# EAGLE design Stepper Tester (EAGLE 7.2.0)
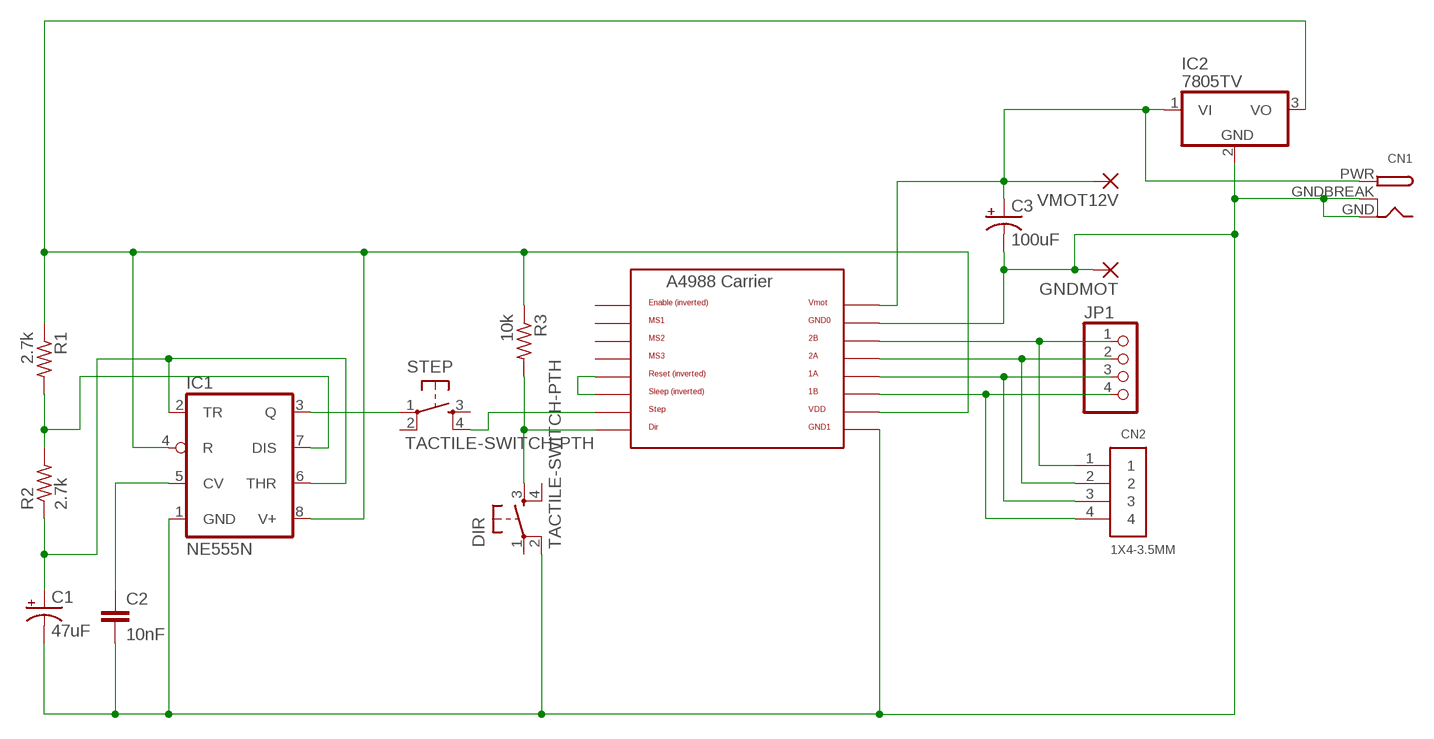
[diagram p0: schematic, sheet 1]

## Parts
C1  47uF  CPOL-USB45181B  [B45181B]
C2  10nF  C-EU050-024X044  [C050-024X044]
C3  100uF  CPOL-USE3.5-10  [E3,5-10]
CN1  DCBARRELPTH  [DCJACK_2MM_PTH]
CN2  1X4-3.5MM  [1X04-3.5MM]
DIR  TACTILE-SWITCH-PTH  [TAC-SWITCH-PTH]
GNDMOT  3,81/1,4  [3,81/1,4]
IC1  NE555N  [DIL08-ROUND]
IC2  7805TV  [TO220V]
JP1  PINHD-1X4  [1X04]
R1  2.7k  R-US_0414/15  [0414/15]
R2  2.7k  R-US_0414/15  [0414/15]
R3  10k  R-US_0414/15  [0414/15]
STEP  TACTILE-SWITCH-PTH  [TAC-SWITCH-PTH]
U$1  A4983CARRIER  [A4988BREAKOUT]
VMOT12V  3,81/1,4  [3,81/1,4]

## Nets
N$2: C2.1 IC1.5(CV)
N$3: C1.+ IC1.2(TR) IC1.6(THR) R2.1
N$4: IC1.7(DIS) R1.2 R2.2
N$5: IC1.4(R) IC1.8(V+) IC2.3(VO) R1.1 R3.1 U$1.VDD
N$6: IC1.3(Q) STEP.1
N$7: STEP.4 U$1.STEP
N$8: CN2.2 JP1.2 U$1.2A
N$9: CN2.3 JP1.3 U$1.1A
N$10: U$1.RST U$1.SLP(SLEEP)
N$11: DIR.3 R3.2 U$1.DIR
N$12: CN2.1 JP1.1 U$1.2B
N$13: CN2.4 JP1.4 U$1.1B
N$14: C3.+ CN1.PWR IC2.1(VI) U$1.VMOT VMOT12V.1(P)
N$15: C1.- C2.2 C3.- CN1.GND CN1.GNDBREAK DIR.2 GNDMOT.1(P) IC1.1(GND) IC2.2(GND) U$1.GND0 U$1.GND1
Unconnected: DIR.1 DIR.4 STEP.2 STEP.3 U$1.EN U$1.MS1 U$1.MS2 U$1.MS3

## Library data of the parts
C1 C3 = rcl:CPOL-US: POLARIZED CAPACITOR, American symbol
C2 = rcl:C-EU: CAPACITOR, European symbol
CN1 = adafruit:DCBARREL: 2.0mm DC Barrel Jack DCJACK_2MM_PTH - Through Hole Jack (4UConnector: 05537)
CN2 = adafruit:1X4: 4-pin connector
DIR STEP = GeekAmmo:TACTILE-SWITCH: Tactile Switch 4 Pins, SPST NO
GNDMOT VMOT12V = wirepad:3,81/1,4: THROUGH-HOLE PAD
IC1 = adafruit:*555: TIMER Changed DIP package to have round (not oval) pin pads http://www.ladyada.net/library/pcb/eaglelibrary.html
IC2 = linear:78*: Positive VOLTAGE REGULATOR Source: http://cache.national.com/ds/LM/LM78L05.pdf http://www.fairchildsemi.com/ds/LM/LM7805.pdf
JP1 = pinhead:PINHD-1X4: PIN HEADER
R1-R3 = rcl:R-US_: RESISTOR, American symbol
U$1 = RepRapjr:A4983CARRIER

## Board
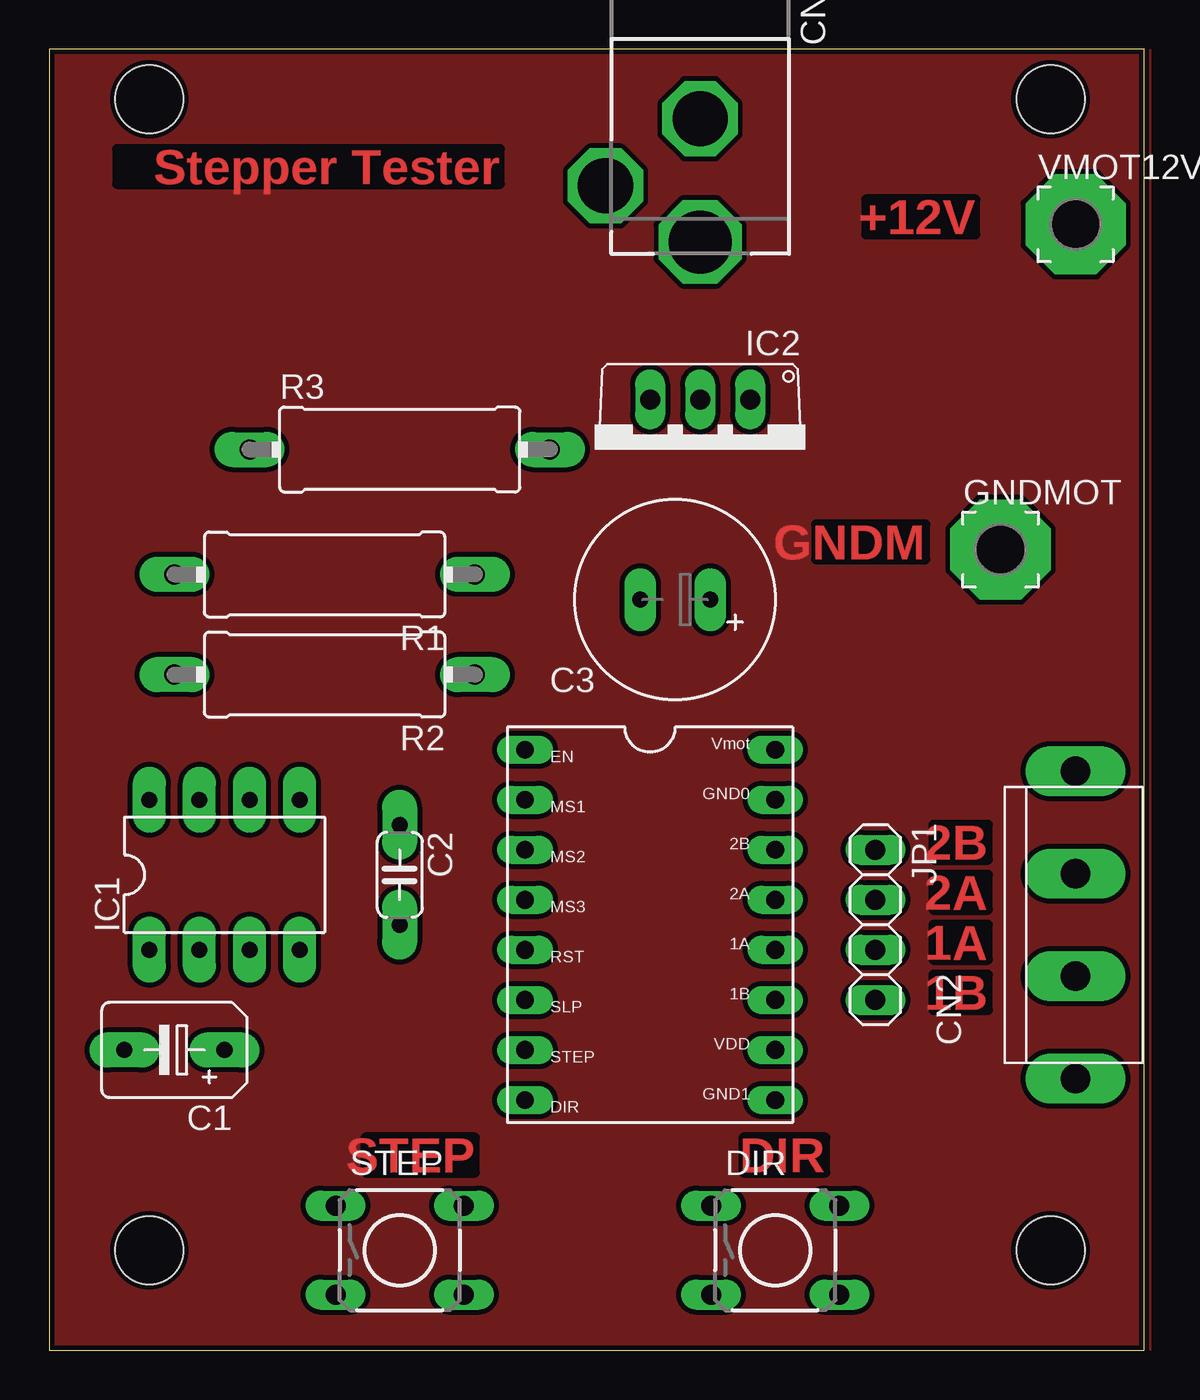
[diagram p1: board, top side]
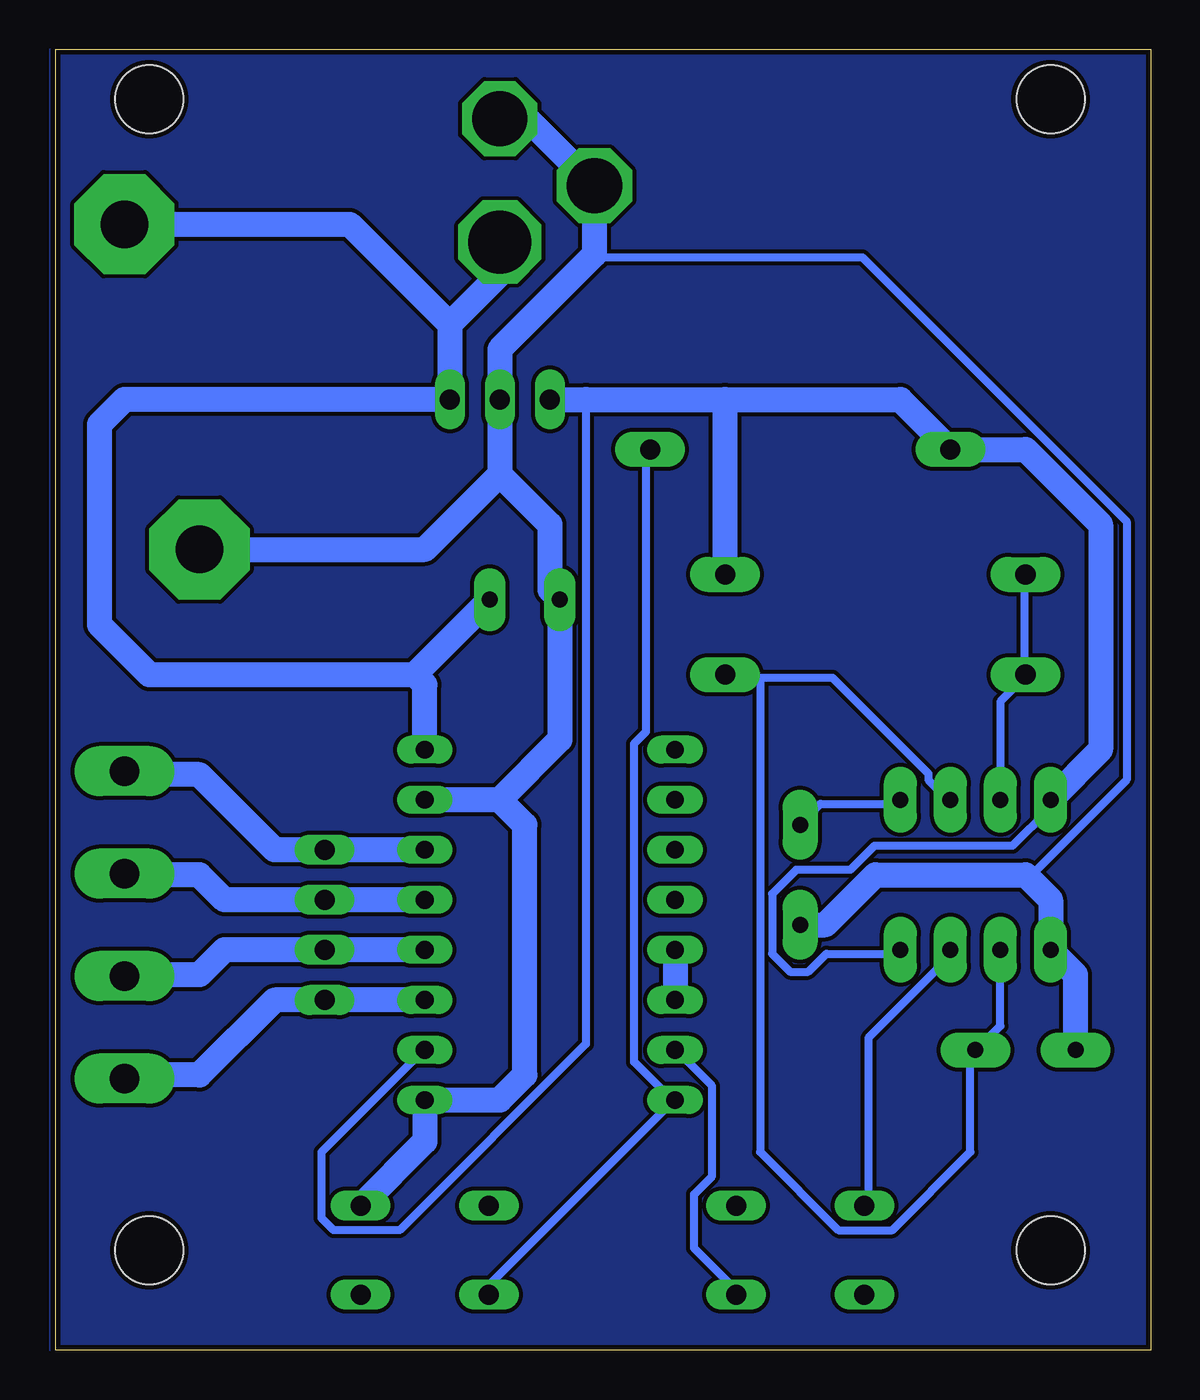
[diagram p2: board, bottom side, seen from below]

Size 55.55 x 66.03 mm. Coordinates in mm from the lower left corner, seen from the top.
Outline: 0,0 55.55,0 55.55,66.03 0,66.03 0,0
Copper layers (1*16): Top 0.035mm / dielectric 1.5mm / Bottom 0.035mm
Design rules "default *": minimum track width 16mil, minimum drill 24mil, track to track 8mil, track to pad 8mil, pad to pad 8mil, via to via 8mil, smd to smd 8mil, copper to edge 10mil, drill to drill 8mil, minimum pad ring 10mil, minimum via ring 8mil, stop-mask expansion 4mil, vias tented up to drill 0mil, thermal gap 10mil
Holes 3.45 mm at 5.08,63.5 5.08,5.08 50.8,5.08 50.8,63.5

### Footprints (pad centres in the part's own frame; a part is rotated, then mirrored left to right if it is on the bottom)
B45181B = drill 0.813 pad 1.778 long: + -2.54,0; - 2.54,0
C050-024X044 = drill 0.813 pad 1.778 long: 1 -2.54,0; 2 2.54,0
E3,5-10 = drill 0.813 pad 1.6 long: + -1.778,0; - 1.778,0
DCJACK_2MM_PTH = drill 2.8 octagon: GND 0,7.35; GNDBREAK 4.8,10.75 | drill 3.2 octagon: PWR 0,13.6
1X04-3.5MM = drill 1.5 pad 2.54 long: 1 -7.8,0; 2 -2.6,0; 3 2.6,0; 4 7.8,0
TAC-SWITCH-PTH = drill 1.016 pad 1.524 long: 1 -3.251,2.261; 2 3.251,2.261; 3 -3.251,-2.261; 4 3.251,-2.261
3,81/1,4 = drill 2.413 pad 5.08 octagon: 1 0,0
DIL08-ROUND = drill 0.813 pad 1.676 long: 1 -3.81,-3.81; 2 -1.27,-3.81; 3 1.27,-3.81; 4 3.81,-3.81; 5 3.81,3.81; 6 1.27,3.81; 7 -1.27,3.81; 8 -3.81,3.81
TO220V = drill 1.016 long: 1 -2.54,-2.54; 2 0,-2.54; 3 2.54,-2.54
1X04 = drill 1.016 long: 1 -3.81,0; 2 -1.27,0; 3 1.27,0; 4 3.81,0
0414/15 = drill 1.016 pad 1.778 long: 1 -7.62,0; 2 7.62,0
A4988BREAKOUT = drill 0.9 long: 1A 8.89,1.27; 1B 11.43,1.27; 2A 6.35,1.27; 2B 3.81,1.27; DIR 16.51,-11.43; EN -1.27,-11.43; GND0 1.27,1.27; GND1 16.51,1.27; MS1 1.27,-11.43; MS2 3.81,-11.43; MS3 6.35,-11.43; RST 8.89,-11.43; SLP 11.43,-11.43; STEP 13.97,-11.43; VDD 13.97,1.27; VMOT -1.27,1.27

### Placement (x,y rotation side)
C1  6.35,15.24 180 top
C2  17.78,24.13 270 top
C3  31.75,38.1 180 top
CN1  33.02,69.85 180 top
CN2  52.07,21.59 270 top
DIR  36.83,5.08 0 top
GNDMOT  48.26,40.64 0 top
IC1  8.89,24.13 0 top
IC2  33.02,45.72 180 top
JP1  41.91,21.59 270 top
R1  13.97,39.37 180 top
R2  13.97,34.29 180 top
R3  17.78,45.72 0 top
STEP  17.78,5.08 0 top
U$1  35.56,29.21 270 top
VMOT12V  52.07,57.15 0 top

### Tracks (layer width: path | path; a pad name or v marks a point on that pad's centre or on a via)
N$1
  pour Top (isolate 0.254): 0,66.04 55.88,66.04 55.88,0 0,0
N$2
  Bottom 0.406: IC1.5 12.8,27.74 16.76,27.74 17.68,26.82 C2.1
N$3
  Bottom 0.406: IC1.2 7.62,16.46 8.84,15.24 C1.+ 9.14,15.24 9.14,10.06 13.11,6.1 15.85,6.1 19.81,10.06 19.81,34.14 | 19.81,34.14 21.34,34.14 R2.1 | 19.81,34.14 16.15,34.14 11.28,29.26 11.28,28.96 10.36,28.04 IC1.6
N$4
  Bottom 0.406: IC1.7 7.62,32.92 6.4,34.14 R2.2 6.4,34.44 6.4,39.32 R1.2
N$5
  Bottom 0.406: 28.65,48.26 28.65,15.54 38.1,6.1 41.45,6.1 42.06,6.71 42.06,10.06 36.88,15.24 U$1.VDD | IC1.4 12.8,20.12 16.46,20.12 17.37,19.2 18.29,19.2 19.2,20.12 19.2,23.16 17.98,24.38 15.24,24.38 14.02,25.6 7.01,25.6 5.18,27.43 IC1.8
  Bottom 1.27: IC2.3 28.65,48.26 21.59,48.26 | 21.59,48.26 12.7,48.26 R3.1 6.35,45.72 2.54,41.91 2.54,30.48 IC1.8 | R1.1 21.59,48.26
N$6
  Bottom 0.406: STEP.1 14.33,7.62 14.33,15.85 10.06,20.12 IC1.3
N$7
  Bottom 0.406: U$1.STEP 24.08,15.24 22.25,13.41 22.25,8.84 23.16,7.92 23.16,5.18 21.03,3.05 STEP.4
N$8
  Bottom 1.27: U$1.2A JP1.2 46.99,22.86 48.26,24.13 52.01,24.13 CN2.2
N$9
  Bottom 1.27: U$1.1A JP1.3 46.99,20.32 48.26,19.05 52.01,19.05 CN2.3
N$10
  Bottom 1.27: U$1.RST U$1.SLP
N$11
  Bottom 0.406: DIR.3 33.83,3.05 24.38,12.5 U$1.DIR 24.38,12.8 26.21,14.63 26.21,30.79 25.6,31.39 25.6,45.72 R3.2
N$12
  Bottom 1.27: U$1.2B JP1.1 44.45,25.4 48.26,29.21 51.89,29.21 CN2.1
N$13
  Bottom 1.27: U$1.1B JP1.4 44.45,17.78 48.26,13.97 51.89,13.97 CN2.4
N$14
  Bottom 1.27: CN1.PWR 33.02,54.61 35.56,52.07 | 35.56,52.07 IC2.1 52.07,48.26 53.34,46.99 53.34,36.83 50.8,34.29 37.34,34.29 | VMOT12V.1 40.64,57.15 35.56,52.07 | 37.34,34.29 C3.+ | U$1.VMOT 36.83,33.78 37.34,34.29
N$15
  Bottom 0.406: 6.2,23.98 1.22,28.96 1.22,42.06 14.63,55.47 27.74,55.47 28.22,55.6
  Bottom 1.27: CN1.GND 31.62,62.5 CN1.GNDBREAK 28.22,55.6 33.02,50.8 IC2.2 33.02,44.45 | 33.02,44.45 30.48,41.91 30.48,38.61 C3.- 29.97,30.99 33.02,27.94 | GNDMOT.1 36.83,40.64 33.02,44.45 | 33.02,27.94 U$1.GND0 | 33.02,27.94 31.75,26.67 31.75,13.97 33.02,12.7 U$1.GND1 36.83,10.59 DIR.2 | C1.- 3.81,19.05 IC1.1 5.08,22.86 6.2,23.98 6.35,24.13 13.97,24.13 16.51,21.59 C2.2
N$16
  pour Bottom: 0,66.04 55.88,66.04 55.88,0 0,0

### Text on the board
Top: Stepper Tester | +12V | GNDM | 2B | 2A | 1A | 1B | STEP | DIR